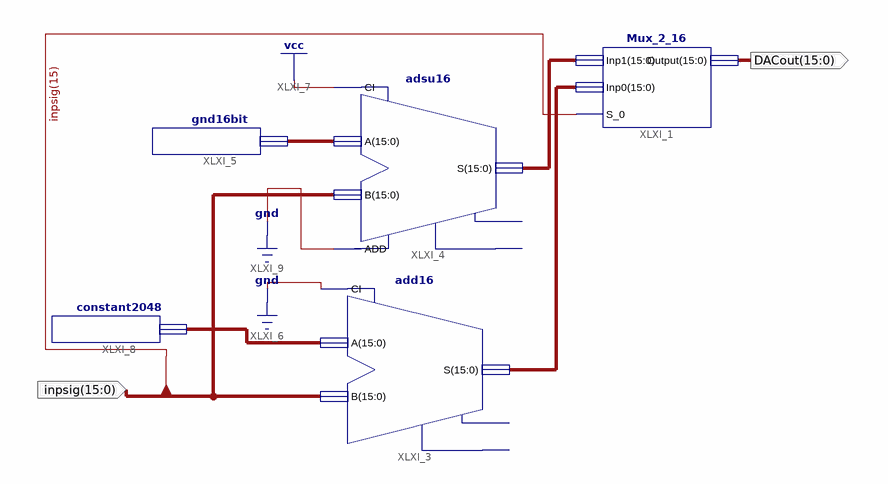
[diagram p0: schematic sheet 1]
// Xilinx ISE schematic DACout.sch (spartan3) as structural Verilog: 5 symbols, 2 ports
module DACout (
  input  [15:0] inpsig,
  output [15:0] DACout
);

  wire [15:0] XLXN_2, XLXN_3, XLXN_7, XLXN_10;

  Mux_2_16 XLXI_1 (.Inp1(XLXN_2), .Inp0(XLXN_3), .S_0(inpsig[15]), .Output(DACout));
  add16 XLXI_3 (.A(XLXN_10), .B(inpsig), .CI(1'b0), .S(XLXN_3));  // open: CO, OFL
  adsu16 XLXI_4 (.A(XLXN_7), .ADD(1'b0), .B(inpsig), .CI(1'b1), .S(XLXN_2));  // open: CO, OFL
  gnd16bit XLXI_5 (.x_constant(XLXN_7));
  constant2048 XLXI_8 (.x_constant(XLXN_10));
endmodule
